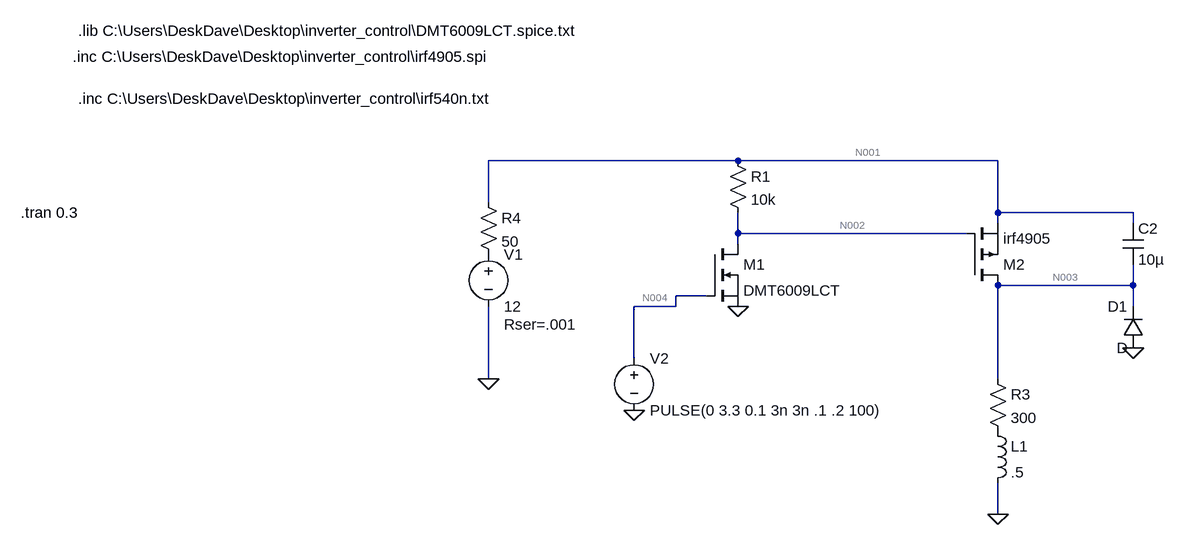
[diagram p0: schematic controller.asc]
controller.asc, the LTspice schematic file:
Version 4.1
SHEET 1 1256 680
WIRE 416 -144 32 -144
WIRE 816 -144 416 -144
WIRE 32 -80 32 -144
WIRE 816 -64 816 -144
WIRE 1024 -64 816 -64
WIRE 816 -48 816 -64
WIRE 1024 -48 1024 -64
WIRE 416 -32 416 -64
WIRE 768 -32 416 -32
WIRE 416 -16 416 -32
WIRE 1024 48 1024 16
WIRE 1024 48 816 48
WIRE 368 64 320 64
WIRE 320 80 320 64
WIRE 320 80 256 80
WIRE 1024 80 1024 48
WIRE 256 160 256 80
WIRE 32 192 32 80
WIRE 816 192 816 48
WIRE 816 400 816 352
FLAG 32 192 0
FLAG 416 80 0
FLAG 256 240 0
FLAG 816 400 0
FLAG 1024 144 0
SYMBOL voltage 32 -16 R0
WINDOW 123 0 0 Left 0
WINDOW 39 24 124 Left 2
SYMATTR InstName V1
SYMATTR Value 12
SYMATTR SpiceLine Rser=.001
SYMBOL nmos 368 -16 R0
SYMATTR InstName M1
SYMATTR Value DMT6009LCT
SYMATTR Prefix X
SYMBOL voltage 256 144 R0
WINDOW 123 0 0 Left 0
WINDOW 39 0 0 Left 0
SYMATTR InstName V2
SYMATTR Value PULSE(0 3.3 0.1 3n 3n .1 .2 100)
SYMBOL res 400 -160 R0
SYMATTR InstName R1
SYMATTR Value 10k
SYMBOL pmos 768 48 M180
SYMATTR InstName M2
SYMATTR Value irf4905
SYMATTR Prefix X
SYMBOL res 800 176 R0
SYMATTR InstName R3
SYMATTR Value 300
SYMBOL ind 800 256 R0
SYMATTR InstName L1
SYMATTR Value .5
SYMBOL cap 1008 -48 R0
SYMATTR InstName C2
SYMATTR Value 10µ
SYMBOL res 16 -96 R0
SYMATTR InstName R4
SYMATTR Value 50
SYMBOL diode 1040 144 R180
WINDOW 0 24 64 Left 2
WINDOW 3 24 0 Left 2
SYMATTR InstName D1
TEXT -688 -64 Left 2 !.tran 0.3
TEXT -600 -344 Left 2 !.lib C:\\Users\\DeskDave\\Desktop\\inverter_control\\DMT6009LCT.spice.txt
TEXT -608 -304 Left 2 !.inc C:\\Users\\DeskDave\\Desktop\\inverter_control\\irf4905.spi
TEXT -600 -240 Left 2 !.inc C:\\Users\\DeskDave\\Desktop\\inverter_control\\irf540n.txt

The netlist it stands for:
* controller.asc
V1 P001 0 12 Rser=.001
X§M1 N002 N004 0 DMT6009LCT  ; pins D G S
V2 N004 0 PULSE(0 3.3 0.1 3n 3n .1 .2 100)
R1 N001 N002 10k
X§M2 N003 N002 N001 irf4905  ; pins D G S
R3 N003 P002 300
L1 P002 0 .5
C2 N001 N003 10µ
R4 N001 P001 50
D1 0 N003 D
.model D D
.lib standard.dio
.tran 0.3
.lib C:\Users\DeskDave\Desktop\inverter_control\DMT6009LCT.spice.txt
.inc C:\Users\DeskDave\Desktop\inverter_control\irf4905.spi
.inc C:\Users\DeskDave\Desktop\inverter_control\irf540n.txt
.backanno
.end

* Results of the author's LTspice run, read from the files saved beside the schematic
* Operating Point, zero values left out:
*   V(n002) = 12 V
*   V(n001) = 12 V
*   V(n003) = 1.64 mV
*   V(p001) = 12 V
*   I(V1) = -5.467 µA
*   I(R4) = -5.467 µA
*   I(L1) = 5.467 µA
*   I(R3) = 5.467 µA
*   I(V2) = 12.01 pA
*   I(R1) = 283.6 pA
*   Ix(m2:1) = -5.467 µA
*   Ix(m2:2) = 12 pA
*   Ix(m2:3) = 5.467 µA
*   Ix(m1:10) = 271.7 pA
*   Ix(m1:20) = -12.01 pA
*   Ix(m1:30) = -259.9 pA
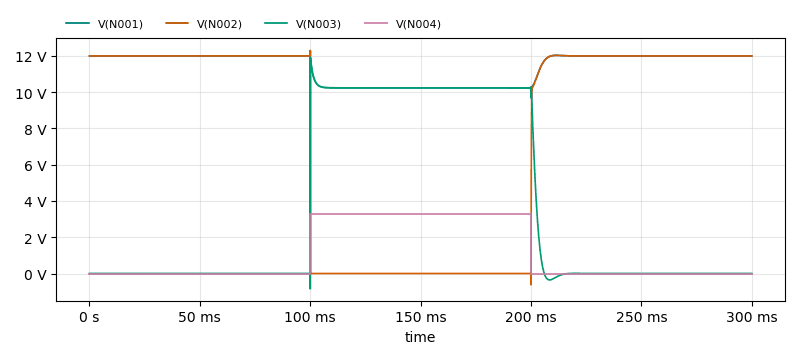
[diagram p1: Transient Analysis of controller.asc, plotted from the saved traces]
* Transient Analysis, 1 run:
*   V(N001): min 8.463 V, max 12.27 V, average 11.4 V, rms 11.43 V, last 12 V
*   V(N002): min -620.1 mV, max 12.31 V, average 7.975 V, rms 9.77 V, last 12 V
*   V(N003): min -843.7 mV, max 11.93 V, average 3.49 V, rms 5.966 V, last 1.638 mV
*   V(N004): min 0 V, max 3.3 V, average 1.1 V, rms 1.905 V, last 0 V